# Altium schematic sheet INDICATORS.SchDoc
size Letter
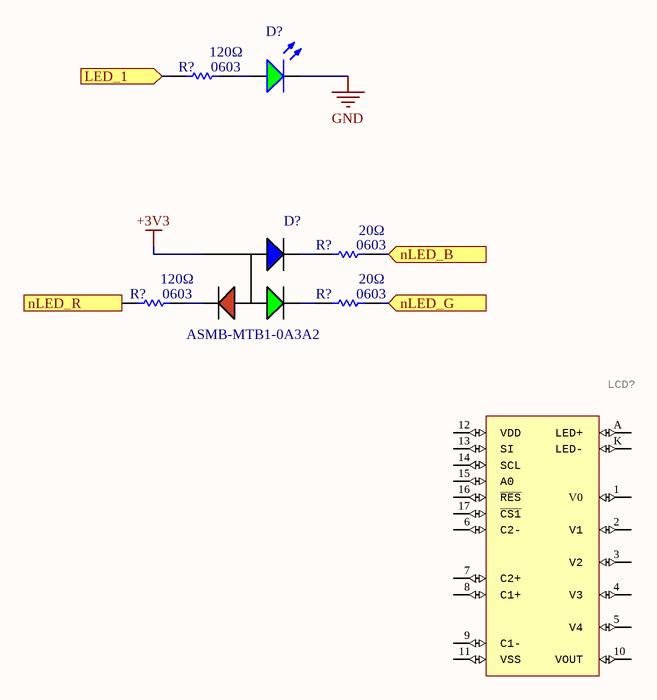
[diagram p0: INDICATORS.SchDoc]

## Parts
(Parts that share a designator on the sheet are numbered #1, #2 ... from top to bottom, then left to right.)
D?#1  (no value)  [LED_0805_LINE]
D?#2  Manufacturer Part Number 1: ASMB-MTB1-0A3A2  [LED_RGB]  (hidden comment: *)
LCD?  (no value)  [NHDC12832A1ZFSWFBW3V3]
R?#1  value 120Ω  Case/Package: 0603  [RESC0603(1608)_N]
R?#2  value 20Ω  Case/Package: 0603  [RESC0603(1608)_N]
R?#3  value 120Ω  Case/Package: 0603  [RESC0603(1608)_N]
R?#4  value 20Ω  Case/Package: 0603  [RESC0603(1608)_N]

## Ports
LED_1 (in), nLED_B (in), nLED_G (in), nLED_R (in)

## Nets
+3V3: D?#2.4
GND: D?#1.2(K)
LED_1: R?#1.1 ; port LED_1
nLED_B: R?#2.2 ; port nLED_B
nLED_G: R?#4.2 ; port nLED_G
nLED_R: R?#3.1 ; port nLED_R
NetD?#1_1: D?#1.1(A) R?#1.2
NetD?#2_1: D?#2.1 R?#3.2
NetD?#2_2: D?#2.2 R?#4.1
NetD?#2_3: D?#2.3 R?#2.1

Not connected (* = marked no-connect by the designer): LCD? 1(V0) 2(V1) 3(V2) 4(V3) 5(V4) 6(C2-) 7(C2+) 8(C1+) 9(C1-) 10(VOUT) 11(VSS) 12(VDD) 13(SI) 14(SCL) 15(A0) 16(~{RES}) 17(~{CS1}) A(LED+) K(LED-)

## Notes on the sheet
- Title
- Size:
- Date:
- Letter
- Drawn By:
- Sheet
- of
- File:

## Library data of the parts
D?#1 = DIO_LED_G: LED GREEN DIFFUSED 0805 SMD; Manufacturer Part Number 1: LG R971-KN-1; Manufacturer 1: OSRAM; Forward Voltage Drop: 2.2V; Package: 0805 (2012 Metric); Supplier Part Number 1: 475-1410-1-ND; Supplier 1: Digi-Key; Mount: Surface Mount
D?#2 = LED_RGB: LED RGB DIFFUSED 4PLCC SMD; Manufacturer 1: Broadcom; Color: Blue,Green,Red; Lens Color: White; Viewing Angle: 115°; Lens Style: Round; Luminous Intensity: 350mcd; Dominant Wavelength: 470nm; Forward Voltage: 3.1V; Test Current: 20mA; Supplier 1: Digi-Key; Stock 1: 142531; Pricing 1: 1=0.60000, 10=0.47100, 100=0.30210, 500=0.25980, 1000=0.20059 (USD); RoHS: Yes; Mount: Surface Mount; Case/Package: PLCC; Number of Pins: 4; Packaging: Cut Tape; Lens Transparency: Diffused; Length: 3.2mm; Height: 1.9mm; Width: 2.8mm; REACH SVHC: No SVHC; ComponentLink1URL: http://www.farnell.com/datasheets/2111106.pdf?src-supplier=Farnell; ComponentLink1Description: http://www.farnell.com/datasheets/2111106.pdf?src-supplier=Farnell; ComponentLink2URL: https://docs.broadcom.com/docs/AV02-4194EN?src-supplier=Digi-Key; ComponentLink2Description: https://docs.broadcom.com/docs/AV02-4194EN?src-supplier=Digi-Key; ComponentLink3URL: http://www.farnell.com/datasheets/1801564.pdf?src-supplier=Element14; ComponentLink3Description: http://www.farnell.com/datasheets/1801564.pdf?src-supplier=Element14; ComponentLink4URL: http://www.farnell.com/datasheets/2111106.pdf?src-supplier=Newark; ComponentLink4Description: http://www.farnell.com/datasheets/2111106.pdf?src-supplier=Newark; Supplier Part Number 1: 516-3280-1-ND
LCD? = NHD-C12832A1Z-FSW-FBW-3V3: LCD COG GRAPHIC 128X32; Manufacturer 1: Newhaven Display Intl; Supplier 1: Digi-Key; Supplier Part Number 1: NHD-C12832A1Z-FSW-FBW-3V3-ND; Manufacturer Part Number 1: NHD-C12832A1Z-FSW-FBW-3V3
R?#1 R?#3 = RES_120Ω_0603: RES SMD 120 OHM 5% 1/10W 0603; Manufacturer 1: Yageo; Manufacturer Part Number 1: RC0603JR-07120RL; Package: 0603 (1608 Metric); Dimensions: 0.063" L x 0.031" W (1.60mm x 0.80mm); Supplier Part Number 1: 311-120GRCT-ND; Supplier 1: Digi-Key; Mount: Surface Mount; Case Code (Metric): 1608; Tolerance: 5%
R?#2 R?#4 = RES_20Ω_0603: RES SMD 20 OHM 5% 1/10W 0603; Manufacturer 1: Yageo; Manufacturer Part Number 1: RC0603JR-0720RL; Package: 0603 (1608 Metric); Dimensions: 0.063" L x 0.031" W (1.60mm x 0.80mm); Supplier Part Number 1: 311-20GRCT-ND; Supplier 1: Digi-Key; Mount: Surface Mount; Case Code (Metric): 1608; Tolerance: 5%